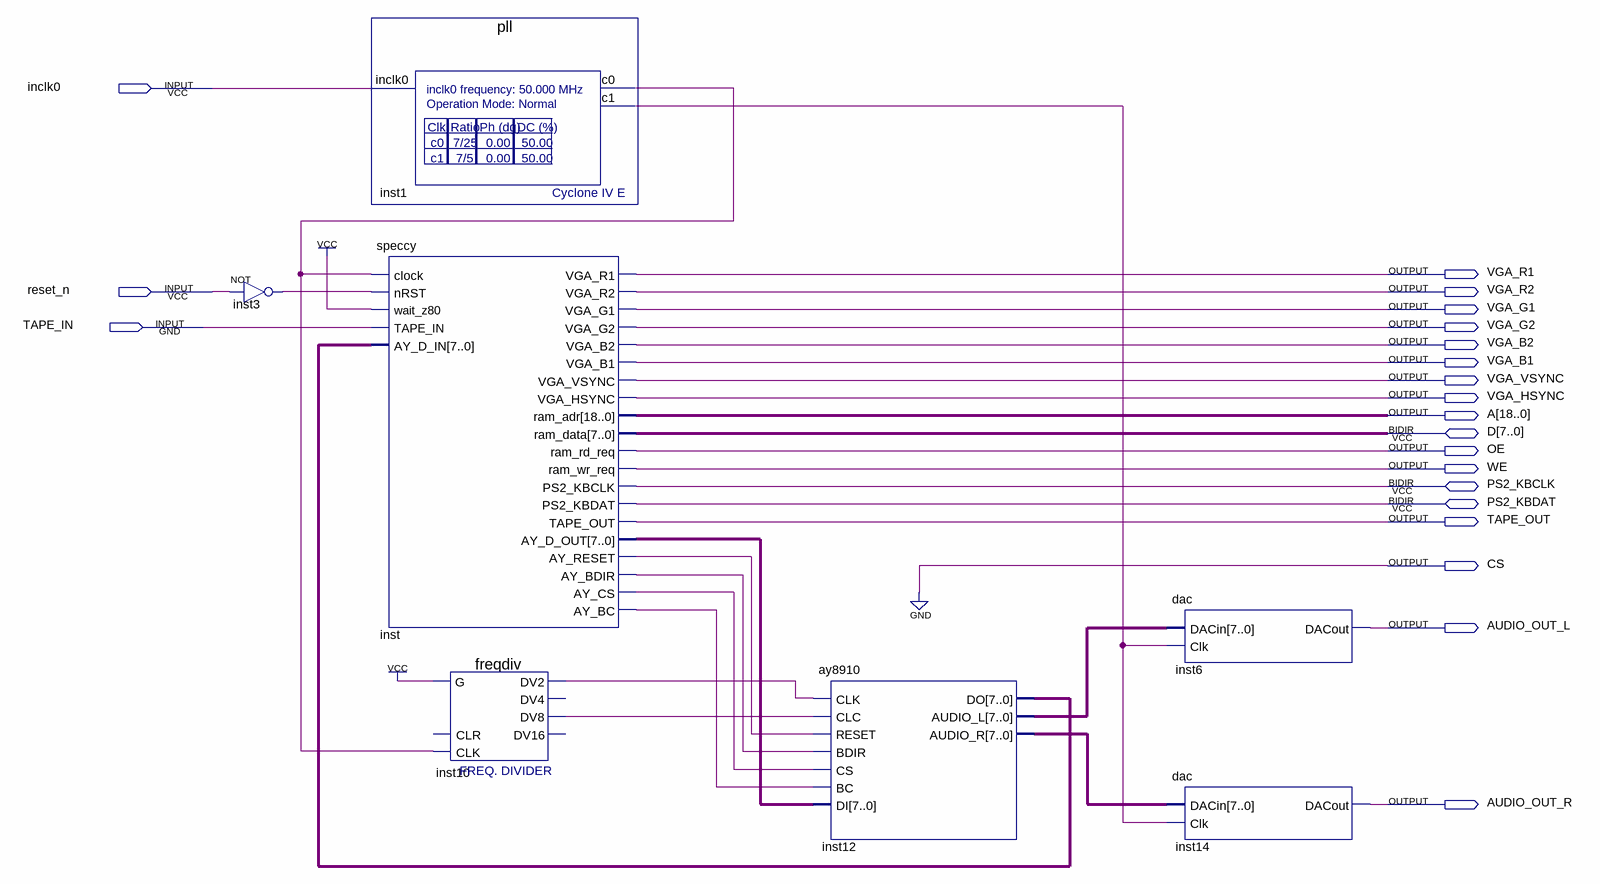
[diagram p0: schematic sheet]
// Quartus schematic spec.bdf as structural Verilog: 7 symbols, 21 pins
module spec (
  input  inclk0,
  input  reset_n,
  input  TAPE_IN,
  inout  [7:0] D,
  inout  PS2_KBCLK,
  inout  PS2_KBDAT,
  output VGA_R1,
  output VGA_R2,
  output VGA_G1,
  output VGA_G2,
  output VGA_B2,
  output VGA_B1,
  output VGA_VSYNC,
  output VGA_HSYNC,
  output [18:0] A,
  output OE,
  output WE,
  output TAPE_OUT,
  output CS,
  output AUDIO_OUT_L,
  output AUDIO_OUT_R
);

  wire inst1_c0, inst1_c1, inst3_out, inst10_dv2, inst10_dv8, inst_ay_bc, inst_ay_bdir, inst_ay_cs,
       inst_ay_reset;
  wire [7:0] inst12_audio_l, inst12_audio_r, inst12_do, inst_ay_d_out;

  not inst3 (inst3_out, reset_n);
  pll inst1 (.inclk0(inclk0), .c0(inst1_c0), .c1(inst1_c1));
  speccy inst (
    .clock(inst1_c0), .nRST(inst3_out), .wait_z80(1'b1), .TAPE_IN(TAPE_IN), .AY_D_IN(inst12_do),
    .VGA_R1(VGA_R1), .VGA_R2(VGA_R2), .VGA_G1(VGA_G1), .VGA_G2(VGA_G2), .VGA_B2(VGA_B2), .VGA_B1(VGA_B1),
    .VGA_VSYNC(VGA_VSYNC), .VGA_HSYNC(VGA_HSYNC), .ram_adr(A), .ram_rd_req(OE), .ram_wr_req(WE),
    .TAPE_OUT(TAPE_OUT), .AY_D_OUT(inst_ay_d_out), .AY_RESET(inst_ay_reset), .AY_BDIR(inst_ay_bdir),
    .AY_CS(inst_ay_cs), .AY_BC(inst_ay_bc), .ram_data(D), .PS2_KBCLK(PS2_KBCLK), .PS2_KBDAT(PS2_KBDAT));
  freqdiv inst10 (.CLK(inst1_c0), .G(1'b1), .DV2(inst10_dv2), .DV8(inst10_dv8));  // open: CLR, DV4, DV16
  ay8910 inst12 (
    .CLK(inst10_dv2), .CLC(inst10_dv8), .RESET(inst_ay_reset), .BDIR(inst_ay_bdir), .CS(inst_ay_cs),
    .BC(inst_ay_bc), .DI(inst_ay_d_out), .DO(inst12_do), .AUDIO_L(inst12_audio_l), .AUDIO_R(inst12_audio_r));
  dac inst6 (.DACin(inst12_audio_l), .Clk(inst1_c1), .DACout(AUDIO_OUT_L));
  dac inst14 (.DACin(inst12_audio_r), .Clk(inst1_c1), .DACout(AUDIO_OUT_R));

  assign CS = 1'b0;
endmodule
